# EAGLE design DWM1000 (EAGLE 7.3.0)
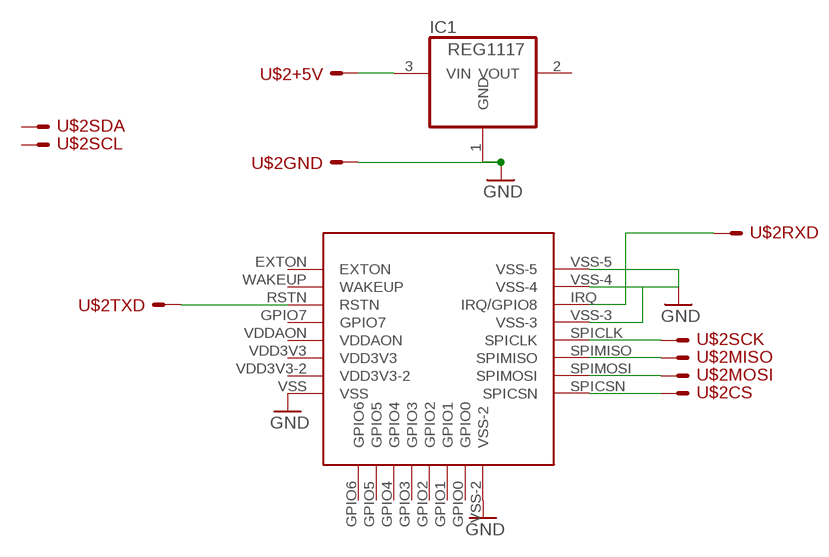
[diagram p0: schematic, sheet 1]

## Parts
IC1  REG1117  [SOT223]
U$1  DWM1000  [DWM1000]
U$2  SPI_BUS  [SPI_BUS]

## Nets
GND: IC1.1(GND) U$1.VSS U$1.VSS-2 U$1.VSS-3 U$1.VSS-4 U$1.VSS-5 U$2.GND
N$1: U$2.CS
N$2: IC1.3(VIN) U$2.+5V
N$3: U$1.SPICLK U$2.SCK
N$4: U$1.SPIMISO U$2.MISO
N$5: U$1.SPIMOSI U$2.MOSI
N$8: U$1.RSTN U$2.TXD
N$9: U$1.IRQ(IRQ/GPIO8) U$2.RXD
Unconnected: IC1.2(VOUT) U$1.EXTON U$1.GPIO0 U$1.GPIO1 U$1.GPIO2 U$1.GPIO3 U$1.GPIO4 U$1.GPIO5 U$1.GPIO6 U$1.GPIO7 U$1.SPICSN U$1.VDD3V3 U$1.VDD3V3-2 U$1.VDDAON U$1.WAKEUP U$2.SCL U$2.SDA

## Library data of the parts
IC1 = burr-brown:REG1117: 800mA and 1A Low Dropout (LDO) Positive Regulator 1.8V, 2.5V, 2.85V, 3.3V, 5V, and Adj; MPN: REG1117; OC_FARNELL: 1097566; OC_NEWARK: 14P6981
U$1 = lieven:DWM1000
U$2 = lieven:SPI_BUS

## Board
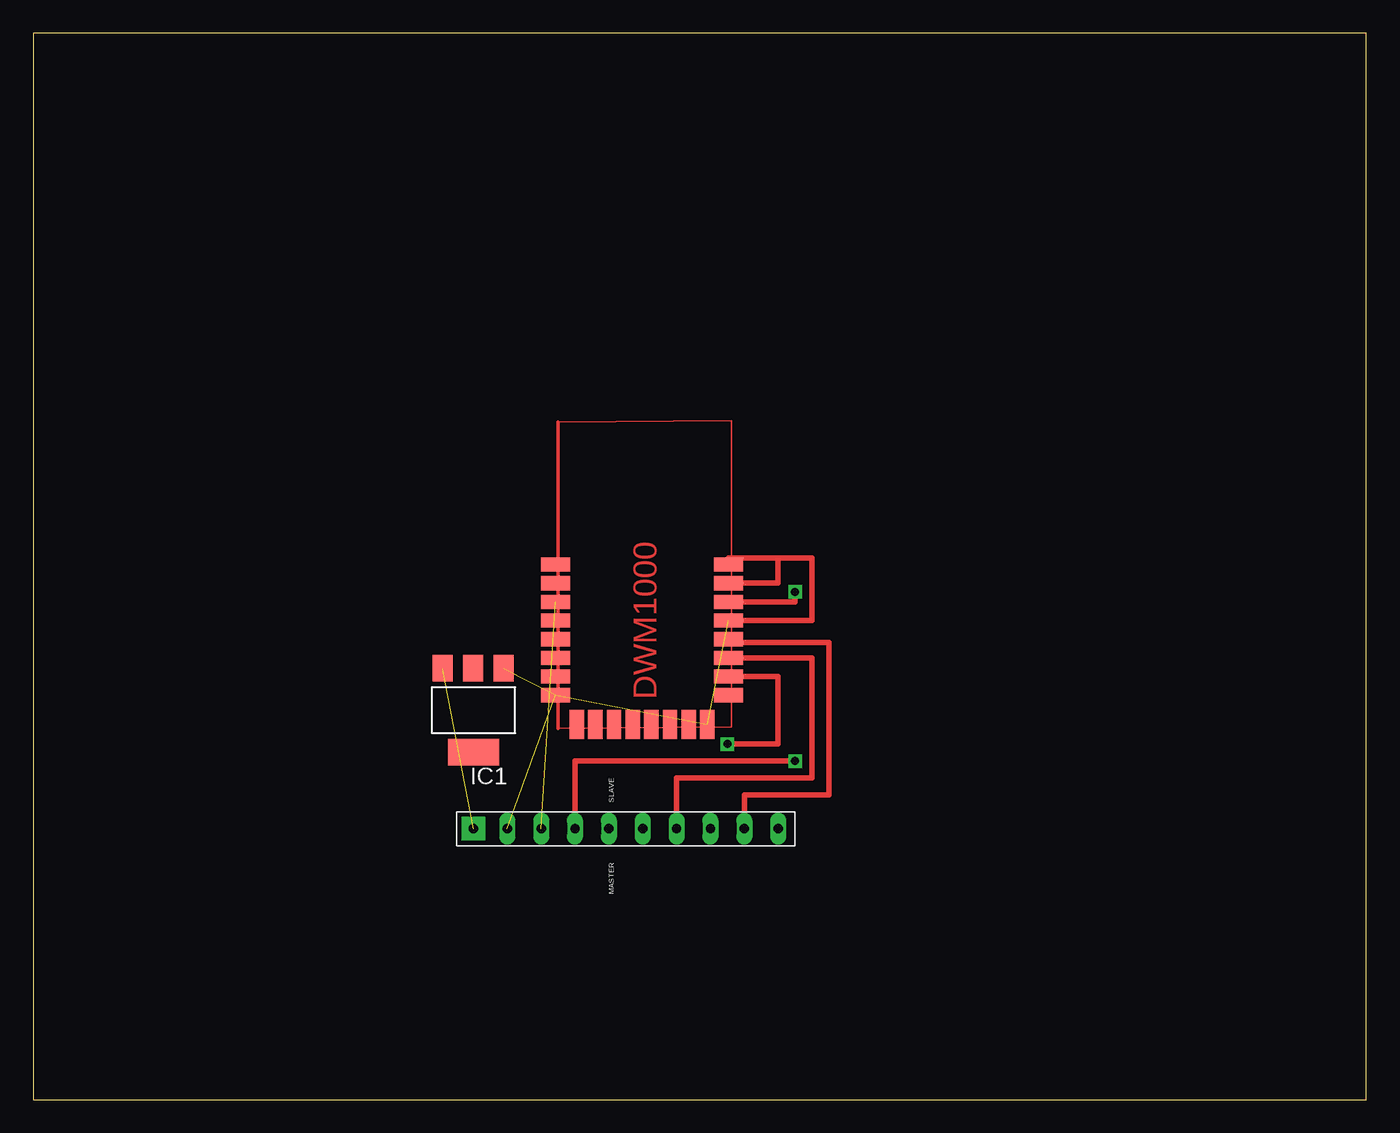
[diagram p1: board, top side]
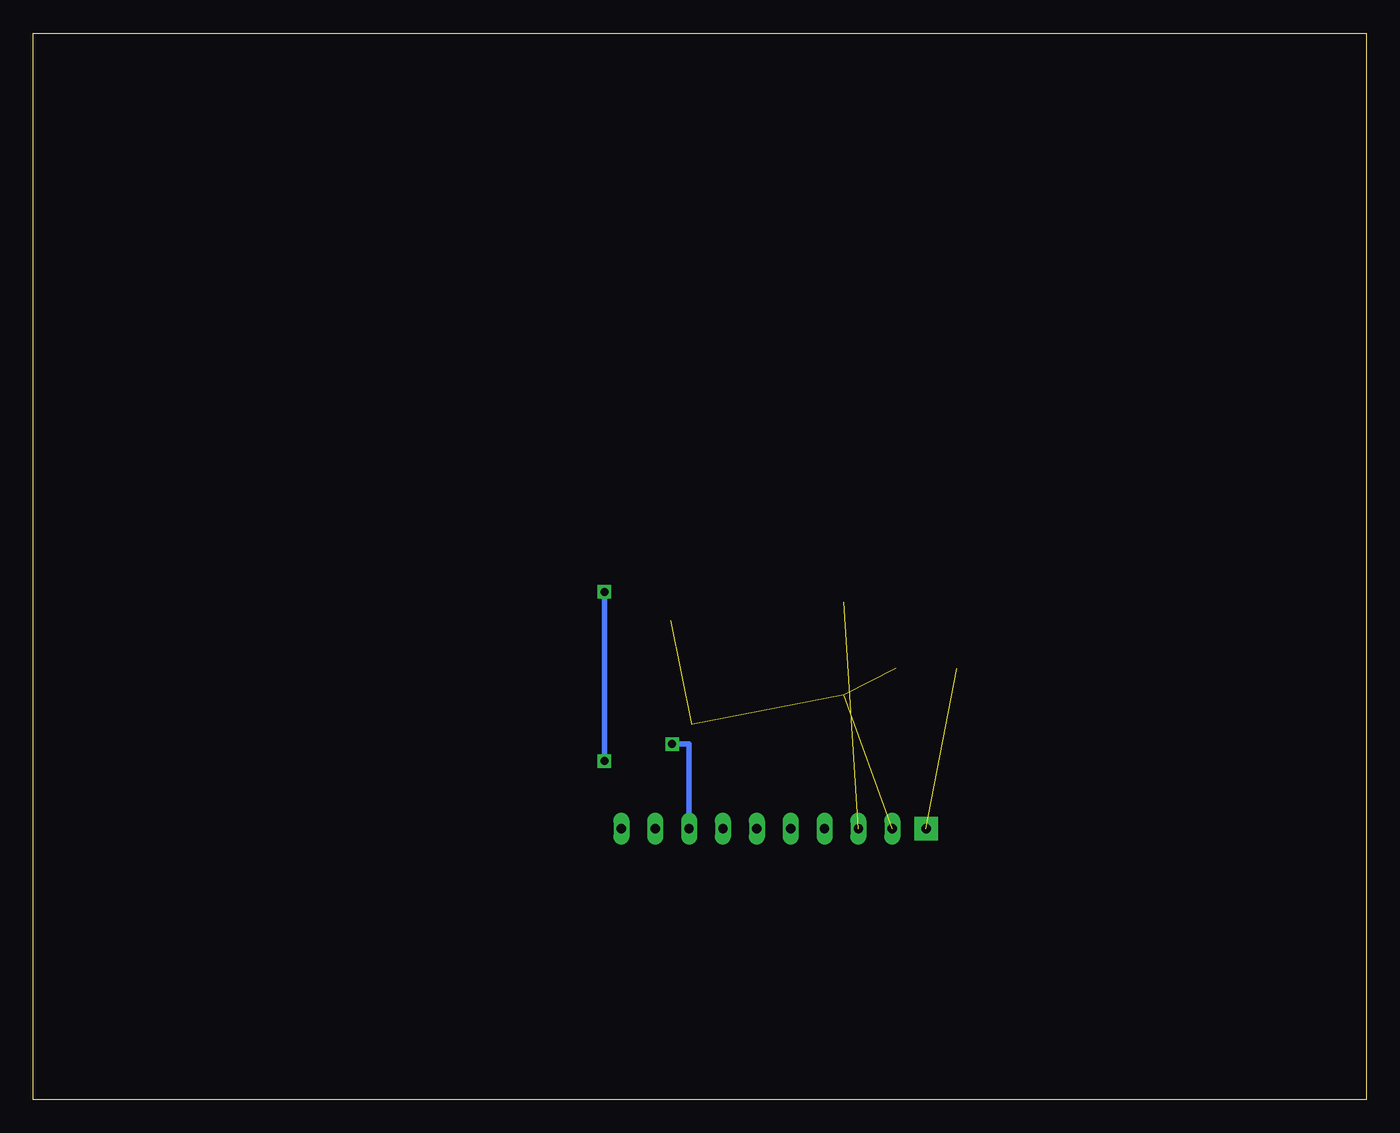
[diagram p2: board, bottom side, seen from below]

Size 100 x 80 mm. Coordinates in mm from the lower left corner, seen from the top.
Outline: 0,0 100,0 100,80 0,80 0,0
Copper layers (1*16): Top 0.035mm / dielectric 1.5mm / Bottom 0.035mm
Design rules "default": minimum track width 10mil, minimum drill 24mil, track to track 8mil, track to pad 8mil, pad to pad 8mil, via to via 8mil, smd to smd 8mil, copper to edge 40mil, drill to drill 8mil, minimum pad ring 10mil, minimum via ring 8mil, stop-mask expansion 4mil, vias tented up to drill 0mil, thermal gap 10mil

### Footprints (pad centres in the part's own frame; a part is rotated, then mirrored left to right if it is on the bottom)
SOT223 = smd 1.499 x 2.007: 1 -2.261,-3.15; 2 0.025,-3.15; 3 2.311,-3.15 | smd 3.81 x 2.007: 4 0,3.15
DWM1000 = smd 2.184 x 1.067: EXTON -0.2,12.2; GPIO7 -0.2,8; IRQ 12.8,9.4; RSTN -0.2,9.4; SPICLK 12.8,6.6; SPICSN 12.8,2.4; SPIMISO 12.8,5.2; SPIMOSI 12.8,3.8; VDD3V3 -0.2,5.2; VDD3V3-2 -0.2,3.8; VDDAON -0.2,6.6; VSS -0.2,2.4; VSS-3 12.8,8; VSS-4 12.8,10.8; VSS-5 12.8,12.2; WAKEUP -0.2,10.8 | smd 1.067 x 2.184: GPIO0 9.8,0.2; GPIO1 8.4,0.2; GPIO2 7,0.2; GPIO3 5.6,0.2; GPIO4 4.2,0.2; GPIO5 2.8,0.2; GPIO6 1.4,0.2; VSS-2 11.2,0.2
SPI_BUS = drill 0.7 pad 1.778 square: +5V 0,0 | drill 0.7 long: CS 0,22.86; GND 0,2.54; MISO 0,15.24; MOSI 0,17.78; RXD 0,7.62; SCK 0,20.32; SCL 0,10.16; SDA 0,12.7; TXD 0,5.08

### Placement (x,y rotation side)
IC1  33.02,29.21 180 top
U$1  39.37,27.94 0 top
U$2  33.02,20.32 270 top

### Tracks (layer width: path | path; a pad name or v marks a point on that pad's centre or on a via)
GND  (4 unrouted)
  Top 0.406: U$1.VSS-3 58.42,35.94 58.42,40.64 55.88,40.64 | 55.88,40.64 52.17,40.64 U$1.VSS-5 | U$1.VSS-4 55.88,38.74 55.88,40.64
N$2  (1 unrouted)
N$3
  Top 0.406: U$2.SCK 53.34,22.86 59.69,22.86 59.69,34.29 52.17,34.29 U$1.SPICLK
N$4
  Top 0.406: U$1.SPIMISO 58.42,33.14 58.42,24.13 48.26,24.13 U$2.MISO
N$5  (via drill 0.6)
  Top 0.406: U$1.SPIMOSI 55.88,31.74 | 55.88,31.74 55.88,31.75 | 55.88,31.74 55.88,26.67 v52.07,26.67
  Bottom 0.406: v52.07,26.67 50.8,26.67 U$2.MOSI
N$8  (1 unrouted)
N$9  (via drill 0.6)
  Top 0.406: U$1.IRQ 57.15,37.34 v57.15,38.1 | v57.15,25.4 40.64,25.4 U$2.RXD
  Bottom 0.406: v57.15,38.1 v57.15,25.4